# Altium schematic sheet Mainboard_Debug_Interface.SchDoc
size A4
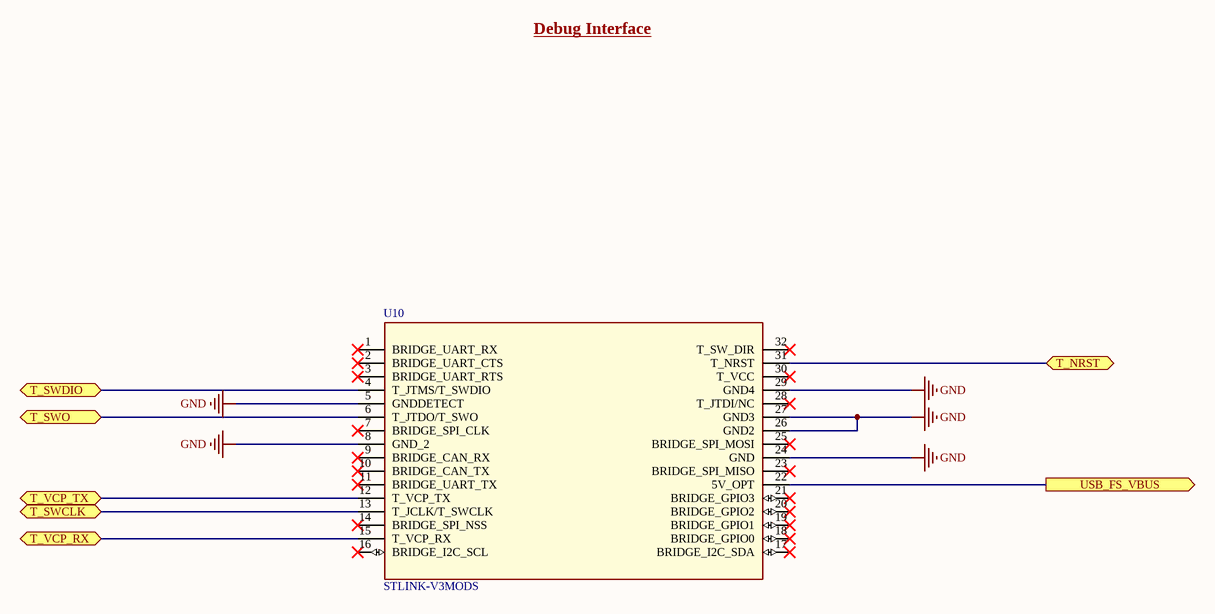
[diagram p0: Mainboard_Debug_Interface.SchDoc]

## Parts
U10  STLINK-V3MODS  [STLINK-V3MODS]

## Ports
T_NRST (bidir), T_SWCLK (bidir), T_SWDIO (bidir), T_SWO (bidir), T_VCP_RX (bidir), T_VCP_TX (bidir), USB_FS_VBUS (out)

## Nets
GND: U10.5(GNDDETECT) U10.8(GND_2) U10.24(GND) U10.26(GND2) U10.27(GND3) U10.29(GND4)
T_NRST: U10.31(T_NRST) ; port T_NRST
T_SWCLK: U10.13(T_JCLK/T_SWCLK) ; port T_SWCLK
T_SWDIO: U10.4(T_JTMS/T_SWDIO) ; port T_SWDIO
T_SWO: U10.6(T_JTDO/T_SWO) ; port T_SWO
T_VCP_RX: U10.15(T_VCP_RX) ; port T_VCP_RX
T_VCP_TX: U10.12(T_VCP_TX) ; port T_VCP_TX
USB_FS_VBUS: U10.22(5V_OPT) ; port USB_FS_VBUS

Not connected (* = marked no-connect by the designer): U10 1(BRIDGE_UART_RX)* 2(BRIDGE_UART_CTS)* 3(BRIDGE_UART_RTS)* 7(BRIDGE_SPI_CLK)* 9(BRIDGE_CAN_RX)* 10(BRIDGE_CAN_TX)* 11(BRIDGE_UART_TX)* 14(BRIDGE_SPI_NSS)* 16(BRIDGE_I2C_SCL)* 17(BRIDGE_I2C_SDA)* 18(BRIDGE_GPIO0)* 19(BRIDGE_GPIO1)* 20(BRIDGE_GPIO2)* 21(BRIDGE_GPIO3)* 23(BRIDGE_SPI_MISO)* 25(BRIDGE_SPI_MOSI)* 28(T_JTDI/NC)* 30(T_VCC)* 32(T_SW_DIR)*

## Notes on the sheet
- Debug Interface

## Library data of the parts
U10 = STLINK-V3MODS: STM32 - Debugger, Programmer (In-Circuit/In-System); MF: STMicroelectronics; MP: STLINK-V3MODS; Price: $12.15; ComponentLink1Description: Digikey; ComponentLink1URL: https://www.digikey.ca/en/products/detail/stmicroelectronics/stlink-v3mods/11610874; ComponentLink2Description: SnapEDA; ComponentLink2URL: https://www.snapeda.com/parts/STLINK-V3MODS/STMicroelectronics/view-part/; ComponentLink3Description: Datasheet; ComponentLink3URL: https://www.st.com/resource/en/data_brief/stlink-v3mods.pdf; Digikey PN: 497-STLINK-V3MODS-ND